# EAGLE design simm_adapter (EAGLE 9.4.2)
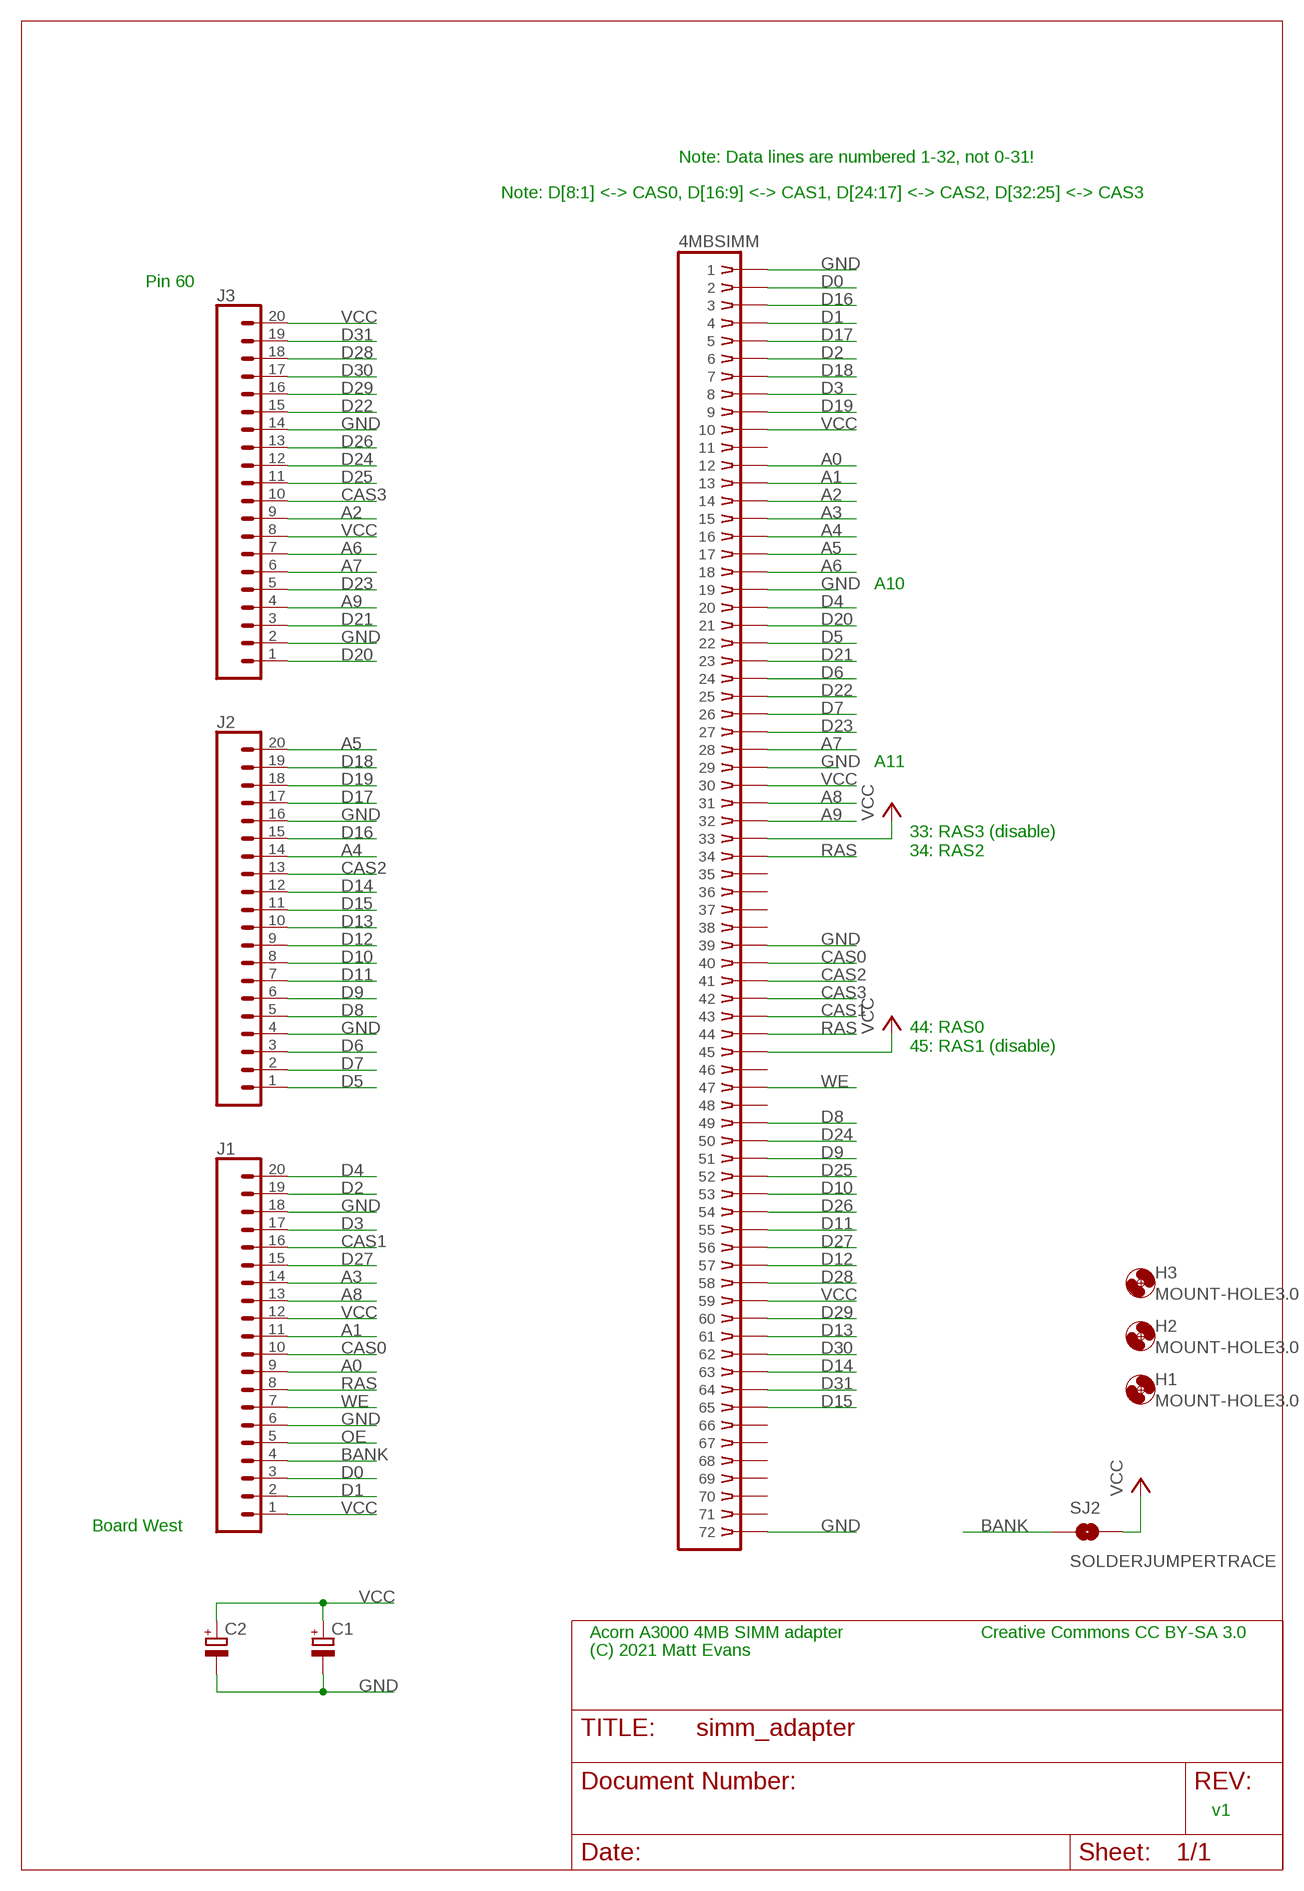
[diagram p0: schematic, sheet 1]

## Parts
4MBSIMM  SIMM72  [73826962]
C1  CPOL-EUCT7343  [CT7343]
C2  CPOL-EUCT7343  [CT7343]
H1  MOUNT-HOLE3.0  [3,0]
H2  MOUNT-HOLE3.0  [3,0]
H3  MOUNT-HOLE3.0  [3,0]
J1  CONN_20  [1X20]
J2  CONN_20  [1X20]
J3  CONN_20  [1X20]
SJ2  SOLDERJUMPERTRACE  [SJ_2S-TRACE]

## Nets
A0: 4MBSIMM.12 J1.9
A1: 4MBSIMM.13 J1.11
A2: 4MBSIMM.14 J3.9
A3: 4MBSIMM.15 J1.14
A4: 4MBSIMM.16 J2.14
A5: 4MBSIMM.17 J2.20
A6: 4MBSIMM.18 J3.7
A7: 4MBSIMM.28 J3.6
A8: 4MBSIMM.31 J1.13
A9: 4MBSIMM.32 J3.4
BANK: J1.4 SJ2.1
CAS0: 4MBSIMM.40 J1.10
CAS1: 4MBSIMM.43 J1.16
CAS2: 4MBSIMM.41 J2.13
CAS3: 4MBSIMM.42 J3.10
D0: 4MBSIMM.2 J1.3
D1: 4MBSIMM.4 J1.2
D2: 4MBSIMM.6 J1.19
D3: 4MBSIMM.8 J1.17
D4: 4MBSIMM.20 J1.20
D5: 4MBSIMM.22 J2.1
D6: 4MBSIMM.24 J2.3
D7: 4MBSIMM.26 J2.2
D8: 4MBSIMM.49 J2.5
D9: 4MBSIMM.51 J2.6
D10: 4MBSIMM.53 J2.8
D11: 4MBSIMM.55 J2.7
D12: 4MBSIMM.57 J2.9
D13: 4MBSIMM.61 J2.10
D14: 4MBSIMM.63 J2.12
D15: 4MBSIMM.65 J2.11
D16: 4MBSIMM.3 J2.15
D17: 4MBSIMM.5 J2.17
D18: 4MBSIMM.7 J2.19
D19: 4MBSIMM.9 J2.18
D20: 4MBSIMM.21 J3.1
D21: 4MBSIMM.23 J3.3
D22: 4MBSIMM.25 J3.15
D23: 4MBSIMM.27 J3.5
D24: 4MBSIMM.50 J3.12
D25: 4MBSIMM.52 J3.11
D26: 4MBSIMM.54 J3.13
D27: 4MBSIMM.56 J1.15
D28: 4MBSIMM.58 J3.18
D29: 4MBSIMM.60 J3.16
D30: 4MBSIMM.62 J3.17
D31: 4MBSIMM.64 J3.19
GND: 4MBSIMM.1 4MBSIMM.19 4MBSIMM.29 4MBSIMM.39 4MBSIMM.72 C1.- C2.- J1.6 J1.18 J2.4 J2.16 J3.2 J3.14
OE: J1.5
RAS: 4MBSIMM.34 4MBSIMM.44 J1.8
VCC: 4MBSIMM.10 4MBSIMM.30 4MBSIMM.33 4MBSIMM.45 4MBSIMM.59 C1.+ C2.+ J1.1 J1.12 J3.8 J3.20 SJ2.2
WE: 4MBSIMM.47 J1.7
Unconnected: 4MBSIMM.11 4MBSIMM.35 4MBSIMM.36 4MBSIMM.37 4MBSIMM.38 4MBSIMM.46 4MBSIMM.48 4MBSIMM.66 4MBSIMM.67 4MBSIMM.68 4MBSIMM.69 4MBSIMM.70 4MBSIMM.71

## Notes on the sheet
- Note: Data lines are numbered 1-32, not 0-31!
- Note: D[8:1] <-> CAS0, D[16:9] <-> CAS1, D[24:17] <-> CAS2, D[32:25] <-> CAS3
- Pin 60
- A10
- A11
- 33: RAS3 (disable)
  34: RAS2
- 44: RAS0
  45: RAS1 (disable)
- Board West
- Acorn A3000 4MB SIMM adapter | Creative Commons CC BY-SA 3.0
- (C) 2021 Matt Evans
- v1

## Library data of the parts
4MBSIMM = con-amp:SIMM72: AMP connector
C1 C2 = rcl:CPOL-EU: POLARIZED CAPACITOR, European symbol; SPICEPREFIX: C
H1-H3 = holes:MOUNT-HOLE: MOUNTING HOLE with drill center marker
J1-J3 = SparkFun-Connectors:CONN_20: Multi connection point. Often used as Generic Header-pin footprint for 0.1 inch spaced/style header connections On any of the 0.1 inch spaced packages, you can populate with these: Break Away Headers - Straight <https://www.sparkfun.com/products/116> (PRT-00116) Break Away Male Headers - Right Angle <https://www.sparkfun.com/products/553> (PRT-00553) Female Headers <https://www.sparkfun.com/products/115> (PRT-00115) Break Away Headers - Machine Pin <https://www.sparkfun.com/products/117> (PRT-00117) Break Away Female Headers - Swiss Machine Pin <https://www.sparkfun.com/products/743> (PRT-00743) For SCREWTERMINALS and SPRING TERMINALS visit here: Screw Terimnals on SparkFun.com <https://www.sparkfun.com/search/results?term=Screw+Terminals> (5mm/3.5mm/2.54mm spacing) This device is also useful as a general connection point to wire up your design to another part of your project. Our various solder wires solder well into these plated through hole pads. Hook-Up Wire - Assortment (Stranded, 22 AWG) <https://www.sparkfun.com/products/11375> (PRT-11375) Hook-Up Wire - Assortment (Solid Core, 22 AWG) <https://www.sparkfun.com/products/11367> (PRT-11367) View the entire wire category on our website here <https://www.sparkfun.com/categories/141> Special notes: Molex polarized connector foot print use with SKU : PRT-08231 with associated crimp pins and housings. 1MM SMD Version SKU: PRT-10208 NOTES ON THE VARIANTS LOCK and LOCK_LONGPADS... This footprint was designed to help hold the alignment of a through-hole component (i.e. 6-pin header) while soldering it into place. You may notice that each hole has been shifted either up or down by 0.005 of an inch from it's more standard position (which is a perfectly straight line). This slight alteration caused the pins (the squares in the middle) to touch the edges of the holes. Because they are alternating, it causes a "brace" to hold the component in place. 0.005 has proven to be the perfect amount of "off-center" position when using our standard breakaway headers. Although looks a little odd when you look at the bare footprint, once you have a header in there, the alteration is very hard to notice. Also,if you push a header all the way into place, it is covered up entirely on the bottom side. Note about LOCK SPECIAL package: This is just like the LOCK variant in that the holes are staggared by 5 mil, but except for the last two holes. They are not altered from the "standard" footprint layout. This is used for a special purpose on the layout of our Graphic LCD Backpack. Make sure you want to use this device before selecting it for you project!
SJ2 = SparkFun-Retired:SOLDERJUMPER: Solder Jumper Standard SMD solder jumper. Used to automate production. Two varients : Normally Open and Normally Closed are the same, but have different paste layers. NC will have a large amount of paste and should jumper during reflow.

## Board
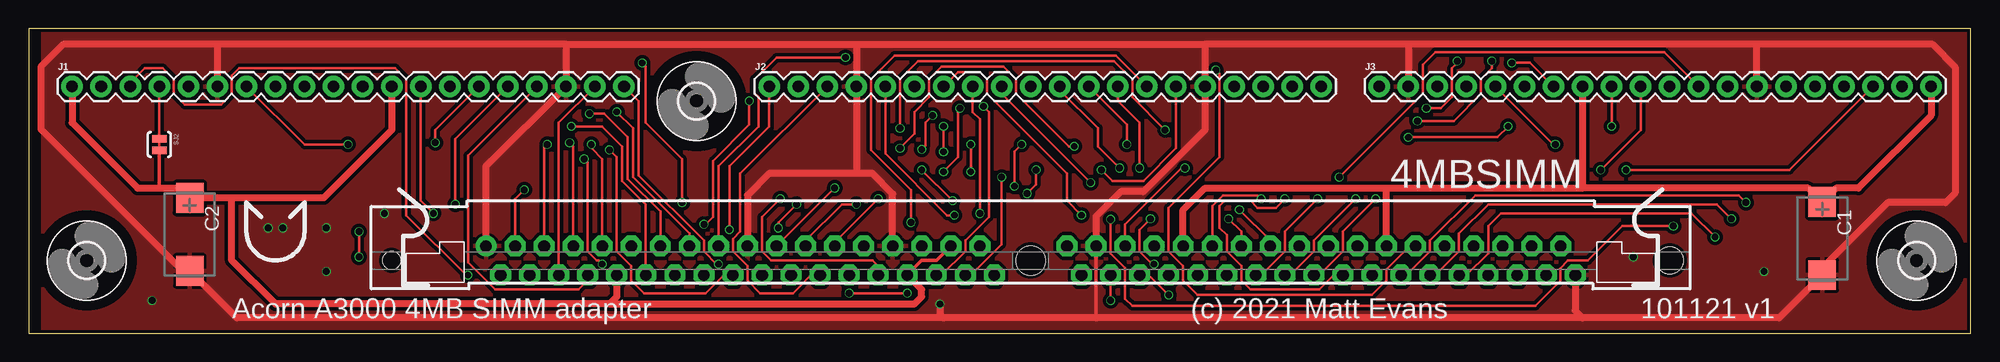
[diagram p1: board, top side]
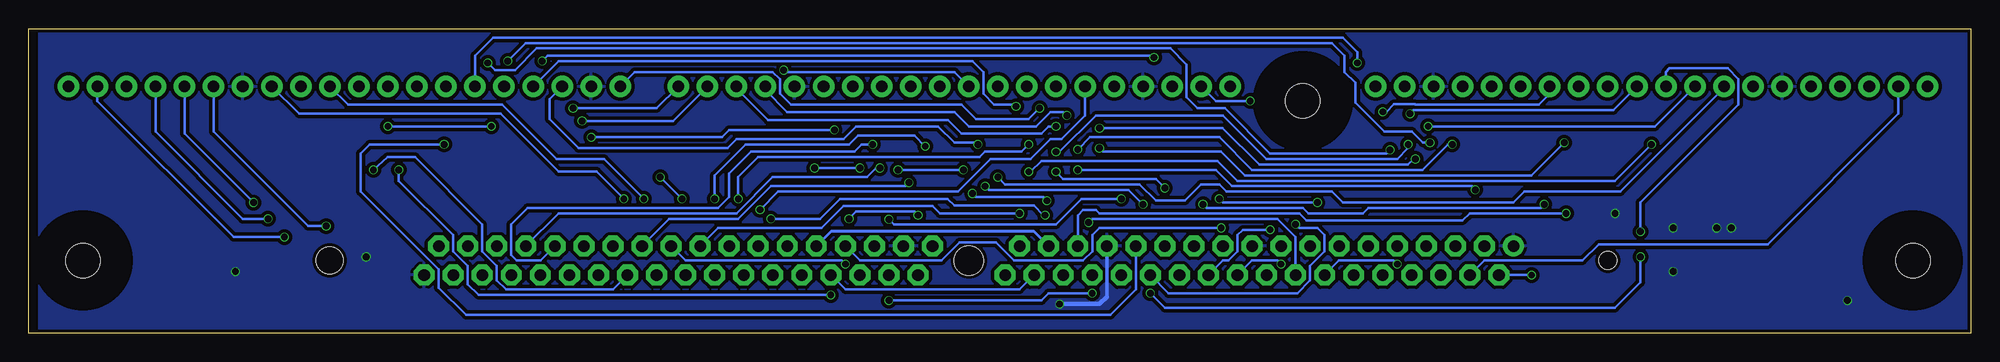
[diagram p2: board, bottom side, seen from below]

Size 169.85 x 26.66 mm. Coordinates in mm from the lower left corner, seen from the top.
Outline: 0,0 169.85,0 169.85,26.66 0,26.66 0,0
Copper layers (1*16): Top 0.035mm / dielectric 1.6mm / Bottom 0.035mm
Design rules "jlcpcb-2layers": minimum track width 5mil, minimum drill 0.3mm, track to track 5mil, track to pad 5mil, pad to pad 5mil, via to via 5mil, smd to smd 5mil, copper to edge 0.2mm, drill to drill 6mil, minimum pad ring 10mil, minimum via ring 3mil, stop-mask expansion 4mil, vias tented up to drill 0mil, thermal gap 10mil

### Footprints (pad centres in the part's own frame; a part is rotated, then mirrored left to right if it is on the bottom)
73826962 = drill 1.016: 1 47.625,-1.27 | drill 1.016 octagon: 2 46.355,1.27; 3 45.085,-1.27; 4 43.815,1.27; 5 42.545,-1.27; 6 41.275,1.27; 7 40.005,-1.27; 8 38.735,1.27; 9 37.465,-1.27; 10 36.195,1.27; 11 34.925,-1.27; 12 33.655,1.27; 13 32.385,-1.27; 14 31.115,1.27; 15 29.845,-1.27; 16 28.575,1.27; 17 27.305,-1.27; 18 26.035,1.27; 19 24.765,-1.27; 20 23.495,1.27; 21 22.225,-1.27; 22 20.955,1.27; 23 19.685,-1.27; 24 18.415,1.27; 25 17.145,-1.27; 26 15.875,1.27; 27 14.605,-1.27; 28 13.335,1.27; 29 12.065,-1.27; 30 10.795,1.27; 31 9.525,-1.27; 32 8.255,1.27; 33 6.985,-1.27; 34 5.715,1.27; 35 4.445,-1.27; 36 3.175,1.27; 37 -3.175,-1.27; 38 -4.445,1.27; 39 -5.715,-1.27; 40 -6.985,1.27; 41 -8.255,-1.27; 42 -9.525,1.27; 43 -10.795,-1.27; 44 -12.065,1.27; 45 -13.335,-1.27; 46 -14.605,1.27; 47 -15.875,-1.27; 48 -17.145,1.27; 49 -18.415,-1.27; 50 -19.685,1.27; 51 -20.955,-1.27; 52 -22.225,1.27; 53 -23.495,-1.27; 54 -24.765,1.27; 55 -26.035,-1.27; 56 -27.305,1.27; 57 -28.575,-1.27; 58 -29.845,1.27; 59 -31.115,-1.27; 60 -32.385,1.27; 61 -33.655,-1.27; 62 -34.925,1.27; 63 -36.195,-1.27; 64 -37.465,1.27; 65 -38.735,-1.27; 66 -40.005,1.27; 67 -41.275,-1.27; 68 -42.545,1.27; 69 -43.815,-1.27; 70 -45.085,1.27; 71 -46.355,-1.27; 72 -47.625,1.27 | hole 2.362: -55.88,0 | hole 1.575: 55.88,0 | hole 2.54: 0,0
CT7343 = smd 2.6 x 2.4: + -3.2,0; - 3.2,0
3,0 = hole 3: 0,0
1X20 = drill 1.016 pad 1.88: 1 0,0; 2 2.54,0; 3 5.08,0; 4 7.62,0; 5 10.16,0; 6 12.7,0; 7 15.24,0; 8 17.78,0; 9 20.32,0; 10 22.86,0; 11 25.4,0; 12 27.94,0; 13 30.48,0; 14 33.02,0; 15 35.56,0; 16 38.1,0; 17 40.64,0; 18 43.18,0; 19 45.72,0; 20 48.26,0
SJ_2S-TRACE = smd 0.635 x 1.27: 1 -0.508,0; 2 0.508,0

### Placement (x,y rotation side)
4MBSIMM  87.63,6.35 180 top
C1  156.84,8.28 270 top
C2  14.1,8.64 270 top
H1  5.08,6.35 0 top
H2  165.1,6.35 0 top
H3  58.42,20.32 0 top
J1  3.81,21.59 0 top
J2  64.77,21.59 0 top
J3  118.11,21.59 0 top
SJ2  11.43,16.51 270 top

### Tracks (layer width: path | path; a pad name or v marks a point on that pad's centre or on a via)
A0  (via drill 0.6)
  Top 0.203: 4MBSIMM.12 53.98,11.27 51.91,13.34 51.91,16.35 50.16,18.1 v47.47,18.1
  Bottom 0.203: v47.47,18.1 27.62,18.1 J1.9
A1  (via drill 0.6)
  Top 0.203: 4MBSIMM.13 55.24,10.64 52.39,13.49 52.39,17.14 50.32,19.21 v49.05,19.21
  Bottom 0.203: v49.05,19.21 48.74,19.53 31.27,19.53 J1.11
A2  (via drill 0.6)
  Top 0.203: v50.16,6.03 49.85,6.35 49.69,6.35 48.9,7.14 48.9,14.92 v48.58,15.24 | v99.38,17.78 96.52,20.64 96.52,22.23 94.93,23.81 77.79,23.81 76.2,22.23 v76.2,17.94 | v120.65,17.14 128.43,17.14 v129.38,18.1 | J3.9 v138.43,18.1
  Bottom 0.203: 4MBSIMM.14 55.24,6.35 50.48,6.35 v50.16,6.03 | v120.65,17.14 109.22,17.14 108.58,17.78 v99.38,17.78 | v138.43,18.1 v129.38,18.1 | v48.58,15.24 48.71,15.24 49.21,14.74 62.23,14.74 65.43,17.94 v76.2,17.94
A3  (via drill 0.6)
  Top 0.203: 4MBSIMM.15 57.78,8.73 52.86,13.65 52.86,17.94 v51.44,19.37
  Bottom 0.203: J1.14 36.83,20.95 37.78,20 48.58,20 48.6,20.03 50.46,20.03 51.12,19.37 v51.44,19.37
A4  (via drill 0.6)
  Top 0.203: v77.15,9.68 77.15,12.54 73.66,16.03 73.66,22.23 75.72,24.29 95.09,24.29 J2.14
  Bottom 0.203: 4MBSIMM.16 59.05,8.41 60.64,10 76.83,10 v77.15,9.68
A5  (via drill 0.6)
  Top 0.203: 4MBSIMM.17 60.33,14.61 63.82,18.1 63.82,20.64 63.5,20.95 63.5,22.23 65.41,24.13 v71.44,24.13 | v124.94,23.81 124.94,23.65 124.46,23.18 124.46,20.64 123.51,19.69 v122.24,19.69
  Bottom 0.203: v71.44,24.13 71.6,24.29 124.46,24.29 v124.94,23.81 | v122.24,19.69 114.94,19.69 J2.20
A6  (via drill 0.6)
  Top 0.203: 4MBSIMM.18 60.8,5.08 59.21,3.49 53.82,3.49 52.7,4.6 52.7,5.87 51.44,7.14 51.44,15.4 v50.8,16.03 | v129.7,23.65 131.29,23.65 J3.7
  Bottom 0.203: v50.8,16.03 51.12,15.72 61.28,15.72 65.25,19.69 67.63,19.69 68.58,20.64 68.58,23.49 70.01,24.92 125.41,24.92 127.32,23.02 129.06,23.02 v129.7,23.65
A7  (via drill 0.6)
  Top 0.203: 4MBSIMM.28 74.3,5.87 73.82,6.35 64.93,6.35 64.14,7.14 64.14,10.16 v65.72,11.75 | v57.15,11.43 57.15,15.24 53.98,18.41 53.98,23.34 v53.66,23.65
  Bottom 0.203: v65.72,11.75 65.41,11.43 v57.15,11.43 | v53.66,23.65 53.66,24.61 54.93,25.88 129.22,25.88 130.81,24.29 J3.6
A8  (via drill 0.6)
  Top 0.203: v35.4,10.48 34.29,11.59 J1.13
  Bottom 0.203: 4MBSIMM.31 78.11,10.32 77.63,10.79 76.52,10.79 76.2,10.48 58.74,10.48 58.1,9.84 44.45,9.84 43.81,10.48 v35.4,10.48
A9  (via drill 0.6)
  Top 0.203: 4MBSIMM.32 79.85,5.08 81.92,7.14 81.92,8.1 83.98,10.16 83.98,19.37 v83.5,19.84
  Bottom 0.203: v83.5,19.84 83.66,20 85.41,20 86.36,20.95 86.36,22.86 87.31,23.81 123.51,23.81 J3.4
BANK
  Top 0.203: SJ2.1 J1.4
CAS0  (via drill 0.6)
  Top 0.203: 4MBSIMM.40 v94.61,2.86 | v76.83,3.49 v71.75,3.49 | v28.89,8.89 v28.89,6.67
  Bottom 0.203: v94.61,2.86 81.28,2.86 80.64,3.49 v76.83,3.49 | v71.75,3.49 70.48,2.22 31.11,2.22 28.89,4.45 v28.89,6.67 | v28.89,8.89 28.89,11.43 20.32,20 20.32,22.23 21.27,23.18 26.35,23.18 26.67,22.86 J1.10
CAS1  (via drill 0.6)
  Top 0.203: v65.56,9.21 65.56,9.68 v67.15,11.27 | v37.31,11.27 37.31,16.99 J1.16
  Bottom 0.203: 4MBSIMM.43 97.16,6.35 90.01,6.35 88.42,7.94 85.25,7.94 83.66,6.35 77.63,6.35 76.83,7.14 76.83,8.57 76.2,9.21 v65.56,9.21 | v67.15,11.27 66.83,10.95 58.42,10.95 57.94,10.48 53.18,10.48 52.7,10.95 37.62,10.95 v37.31,11.27
CAS2  (via drill 0.6)
  Top 0.203: 4MBSIMM.41 95.89,9.53 100.81,14.45 v101.12,14.45 | v97.16,14.45 97.16,18.41 95.25,20.32 J2.13
  Bottom 0.203: v101.12,14.45 v97.16,14.45
CAS3  (via drill 0.6)
  Top 0.203: 4MBSIMM.42 97.95,5.08 v99.69,3.33 | v137.48,14.29 140.97,17.78 J3.10
  Bottom 0.203: v99.69,3.33 130.49,3.33 131.44,4.29 131.44,5.87 132.72,7.14 132.72,8.57 137.48,13.34 v137.48,14.29
D0  (via drill 0.6)
  Top 0.203: v38.42,5.08 38.26,5.08 33.02,10.32 33.02,22.23 32.07,23.18 18.41,23.18 17.78,22.54 17.78,20.95 16.83,20 13.65,20 12.7,20.95 12.7,22.23 11.75,23.18 10.16,23.18 8.89,21.91 J1.3
  Bottom 0.203: v38.42,5.08 4MBSIMM.2
D1
  Bottom 0.203: 4MBSIMM.4 42.55,6.35 33.97,6.35 32.54,7.78 17.78,7.78 6.35,19.21 J1.2
D2
  Top 0.203: 4MBSIMM.6 46.35,18.41 J1.19
D3
  Top 0.203: 4MBSIMM.8 48.9,4.6 48.1,3.81 40.8,3.81 38.42,6.19 38.42,15.56 J1.17
D4  (via drill 0.6)
  Top 0.203: v60.33,6.03 60.17,6.03 59.05,7.14 59.05,8.1 53.34,13.81 53.34,20.32 J1.20
  Bottom 0.203: 4MBSIMM.20 62.87,6.35 60.64,6.35 v60.33,6.03
D5  (via drill 0.6)
  Top 0.203: v61.28,9.05 61.28,14.61 64.77,18.1 J2.1
  Bottom 0.203: 4MBSIMM.22 65.41,6.35 64.93,6.35 64.14,7.14 64.14,8.57 63.66,9.05 v61.28,9.05
D6
  Top 0.203: 4MBSIMM.24 68.42,5.08 66.83,3.49 63.98,3.49 62.87,4.6 62.87,5.87 61.59,7.14 61.59,8.25 62.23,8.89 62.23,13.97 J2.3
D7  (via drill 0.6)
  Top 0.203: v59.05,9.53 59.21,9.53 59.85,10.16 59.85,15.08 63.02,18.26 v63.02,20.32
  Bottom 0.203: 4MBSIMM.26 70.17,3.49 58.9,3.49 57.78,4.6 57.78,5.87 56.52,7.14 56.52,8.57 57.15,9.21 58.74,9.21 v59.05,9.53 | v63.02,20.32 66.04,20.32 J2.2
D8  (via drill 0.6)
  Top 0.203: 4MBSIMM.49 106.05,8.89 v104.93,10 | v80.96,10.32 80.33,10.32 74.93,15.72 J2.5
  Bottom 0.203: v104.93,10 100.65,10 98.9,11.75 89.49,11.75 88.9,11.16 81.95,11.16 81.11,10.32 v80.96,10.32
D9  (via drill 0.6)
  Top 0.203: 4MBSIMM.51 108.58,8.1 v105.89,10.79
  Bottom 0.203: v105.89,10.79 104.3,12.38 88.58,12.38 85.72,15.24 82.23,15.24 80.49,16.99 79.53,16.99 77.47,19.05 J2.6
D10  (via drill 0.6)
  Top 0.203: v83.19,10.48 83.19,18.73 82.55,19.37 J2.8
  Bottom 0.203: 4MBSIMM.53 109.54,9.21 100.49,9.21 98.58,11.11 90.81,11.11 90.17,10.48 v83.19,10.48
D11  (via drill 0.6)
  Top 0.203: v98.42,6.03 98.27,6.03 97.16,7.14 97.16,9.05 v98.11,10 | v92.08,10.32 90.81,11.59 90.81,13.97 83.82,20.95 83.82,22.23 83.19,22.86 81.28,22.86 J2.7
  Bottom 0.203: 4MBSIMM.55 112.39,6.35 98.74,6.35 v98.42,6.03 | v92.08,10.32 92.39,10.64 97.47,10.64 v98.11,10
D12  (via drill 0.6)
  Top 0.203: J2.9 85.09,20.95 v92.87,13.18
  Bottom 0.203: 4MBSIMM.57 113.82,10 107.79,10 104.93,12.86 93.19,12.86 v92.87,13.18
D13  (via drill 0.6)
  Top 0.203: 4MBSIMM.61 120.81,7.62 118.75,5.56 118.75,4.6 117.47,3.33 102.23,3.33 100.97,4.6 100.97,5.87 99.69,7.14 99.69,10.95 104.14,15.4 104.14,22.7 v103.82,23.02
  Bottom 0.203: v103.82,23.02 103.66,22.86 88.9,22.86 J2.10
D14  (via drill 0.6)
  Top 0.203: v96.04,16.51 96.04,18.26 J2.12
  Bottom 0.203: 4MBSIMM.63 125.09,6.35 127.16,6.35 127.64,6.83 127.64,9.53 126.21,10.95 109.54,10.95 108.58,11.91 108.58,13.97 106.68,15.88 97.63,15.88 97,16.51 v96.04,16.51
D15  (via drill 0.6)
  Top 0.203: v95.41,14.45 93.5,16.35 93.5,17.94 90.17,21.27 J2.11
  Bottom 0.203: 4MBSIMM.65 123.51,10.48 107.95,10.48 104.78,13.65 96.52,13.65 95.73,14.45 v95.41,14.45
D16  (via drill 0.6)
  Top 0.203: 4MBSIMM.3 42.55,11.75 v43.34,12.54 | v80.8,11.59 v78.11,14.29 | v88.11,14.29 88.11,13.02 v87.31,12.22 | v93.82,14.29 94.77,13.34 97.47,13.34 100.33,16.19 J2.15
  Bottom 0.203: v43.34,12.54 43.66,12.86 64.61,12.86 66.04,14.29 v78.11,14.29 | v87.31,12.22 87,11.91 81.12,11.91 v80.8,11.59 | v93.82,14.29 v88.11,14.29
D17  (via drill 0.6)
  Top 0.203: 4MBSIMM.5 45.09,16.24 v45.36,16.51 | v79.06,19.05 78.42,18.41 78.42,16.4 v78.11,16.08
  Bottom 0.203: J2.17 105.41,21.27 103.5,19.37 88.9,19.37 87.63,18.1 81.75,18.1 80.48,19.37 79.38,19.37 v79.06,19.05 | v78.11,16.08 77.04,17.14 65.72,17.14 62.85,14.28 47.95,14.28 45.72,16.51 v45.36,16.51
D18  (via drill 0.6)
  Top 0.203: 4MBSIMM.7 47.62,16.35 v47.31,16.67 | v127.95,23.81 127.95,23.18 127,22.23 127,20.95 124.62,18.57 v121.44,18.57
  Bottom 0.203: v47.31,16.67 47.94,16.67 48.9,17.62 51.28,17.62 53.82,20.16 53.82,21.91 54.77,22.86 54.77,24.29 55.88,25.4 126.36,25.4 v127.95,23.81 | v121.44,18.57 113.51,18.57 J2.19
D19  (via drill 0.6)
  Top 0.203: 4MBSIMM.9 50.16,15.24 49.21,16.19 v49.21,16.51 | v80.01,15.88 v80.01,18.1
  Bottom 0.203: v49.21,16.51 49.21,16.19 50.16,15.24 61.59,15.24 65.41,19.05 76.52,19.05 79.69,15.88 v80.01,15.88 | J2.18 107.95,21.42 105.18,18.64 89.45,18.64 88.27,17.46 81.28,17.46 80.64,18.1 v80.01,18.1
D20  (via drill 0.6)
  Top 0.203: v70.48,12.7 4MBSIMM.21 | v80.01,14.13 81.28,15.4 81.28,19.53 v81.44,19.69
  Bottom 0.203: v70.48,12.7 71.28,13.49 79.38,13.49 v80.01,14.13 | J3.1 116.84,22.86 104.78,22.86 104.14,22.23 104.14,20.95 103.19,20 88.27,20 87,18.73 82.39,18.73 v81.44,19.69
D21  (via drill 0.6)
  Top 0.203: 4MBSIMM.23 67.94,8.1 71.12,11.27 v72.39,11.27 | v86.84,16.51 86.2,15.88 v86.2,12.86
  Bottom 0.203: v86.2,12.86 85.88,12.54 73.66,12.54 v72.39,11.27 | v86.84,16.51 87,16.67 88.9,16.67 90.33,18.1 97.47,18.1 98.58,16.99 107.95,16.99 108.74,16.19 121.76,16.19 124.3,18.73 124.3,20.48 J3.3
D22  (via drill 0.6)
  Top 0.203: v143.83,9.37 139.38,9.37 136.37,6.35 134.62,6.35 133.91,5.64 133.91,5.61 133.93,5.58 133.93,4.55 131.76,2.38 96.52,2.38 95.89,3.02 95.89,5.71 94.61,6.99 v94.61,9.96 | v74.3,11.75 70.48,7.94 4MBSIMM.25
  Bottom 0.203: v74.3,11.75 77.79,11.75 80.01,9.53 94.19,9.53 v94.61,9.96 | J3.15 153.67,17.62 145.41,9.37 v143.83,9.37
D23  (via drill 0.6)
  Top 0.203: v133.51,16.51 133.35,16.51 J3.5
  Bottom 0.203: 4MBSIMM.27 73.03,3.81 75.25,1.59 131.6,1.59 133.99,3.97 133.99,5.56 140.81,12.38 140.81,15.72 140.02,16.51 v133.51,16.51
D24  (via drill 0.6)
  Top 0.203: 4MBSIMM.50 107.79,5.08 109.86,7.14 109.86,8.89 v112.71,11.75 | v114.62,13.65 121.92,20.95 121.92,23.49 123.03,24.61 143.03,24.61 J3.12
  Bottom 0.203: v114.62,13.65 v112.71,11.75
D25  (via drill 0.6)
  Top 0.203: 4MBSIMM.52 110.33,5.08 112.39,7.14 112.39,8.1 v116.05,11.75
  Bottom 0.203: v116.05,11.75 119.54,15.24 123.67,15.24 128.43,20 141.92,20 J3.11
D26  (via drill 0.6)
  Top 0.203: 4MBSIMM.54 112.87,5.08 114.94,7.14 114.94,8.89 v117.79,11.75
  Bottom 0.203: v117.79,11.75 120.17,14.13 123.51,14.13 128.59,19.21 146.21,19.21 J3.13
D27  (via drill 0.6)
  Top 0.203: 4MBSIMM.56 114.14,5.08 112.87,3.81 106.84,3.81 106.05,4.6 106.05,5.87 104.78,7.14 104.78,8.57 104.14,9.21 104.14,11.11 104.62,11.59 106.84,11.59 107.47,10.95 109.06,10.95 v109.86,11.75 | v91.44,16.35 90.96,16.35 86.36,20.95 86.36,22.23 85.25,23.34 79.85,23.34 78.74,22.23 78.74,20.64 77.47,19.37 77.47,17.46 v76.2,16.19 | v35.56,16.67 35.56,17.78 J1.15
  Bottom 0.203: v109.86,11.75 109.86,13.81 107.16,16.51 98.11,16.51 97.31,17.3 92.39,17.3 v91.44,16.35 | v76.2,16.19 75.88,15.88 65.56,15.88 63.5,13.81 38.42,13.81 v35.56,16.67
D28  (via drill 0.6)
  Top 0.203: J3.18 153.99,14.29 v139.7,14.29
  Bottom 0.203: 4MBSIMM.58 118.75,3.81 128.11,3.81 128.91,4.6 128.91,5.87 130.18,7.14 130.18,9.53 136.05,15.4 138.43,15.4 v139.7,14.29
D29  (via drill 0.6)
  Top 0.203: 4MBSIMM.60 120.49,5.08 122.56,7.14 122.56,8.1 126.52,12.07 149.54,12.07 v150.18,11.43
  Bottom 0.203: v150.18,11.43 156.21,17.46 J3.16
D30  (via drill 0.6)
  Top 0.203: 4MBSIMM.62 123.03,5.08 125.09,7.14 125.09,8.73 127.64,11.27 147.64,11.27 v148.91,10
  Bottom 0.203: v148.91,10 151.13,10 158.75,17.62 J3.17
D31  (via drill 0.6)
  Top 0.203: 4MBSIMM.64 125.73,5.08 127.64,6.99 127.64,9.37 128.75,10.48 145.41,10.48 v147.48,8.41
  Bottom 0.203: J3.19 163.83,20.32 151.92,8.41 v147.48,8.41
GND  (via drill 0.6)
  Top 0.203: 156.84,5.71 C1.- | 13.49,5.44 C2.-
  Top 0.305: 4MBSIMM.39 93.34,1.32
  Top 0.61: J3.14 151.13,25.27 | 151.13,25.27 166.5,25.27 168.48,23.29 168.48,12.27 167.64,11.43 162.56,11.43 156.84,5.71 | 120.65,25.27 J3.2 | 102.87,25.27 J2.16 102.87,17.78 97.47,12.38 95.5,12.38 93.34,10.22 4MBSIMM.39 | 72.39,25.27 J2.4 72.39,13.97 | 46.99,25.27 72.39,25.27 | 46.99,25.27 J1.18 40.01,14.61 4MBSIMM.1 | 46.99,25.27 16.51,25.27 | 16.51,25.27 J1.6 | 16.51,25.27 3.05,25.27 1.08,23.3 1.08,17.84 13.49,5.44 | 151.13,25.27 120.65,25.27 | 120.65,25.27 102.87,25.27 | C1.- 153.09,1.32 135.89,1.32 | C2.- 18.21,1.32 80.01,1.32 | 135.89,1.32 93.34,1.32 80.01,1.32 | 4MBSIMM.72 135.25,1.96 135.89,1.32 | 4MBSIMM.29 75.56,12.19 73.79,13.97 72.39,13.97 | 72.39,13.97 64.77,13.97 62.87,12.07 4MBSIMM.19 | v79.69,2.54 79.69,1.64 80.01,1.32 | 72.39,25.27 102.87,25.27
  Bottom 0.305: 75.56,3.17 4MBSIMM.29
  Bottom 0.406: v79.69,2.54 76.2,2.54 75.56,3.17
  other vias: 31.11,10.48 26.04,9.21 20.95,9.21 22.23,9.21 26.04,5.4 10.79,2.86 140.34,6.67 151.76,5.4
  pour Top (isolate 0.305): 1.27,26.67 1.27,0 170.18,0 170.18,26.67
  pour Bottom (isolate 0.305): 0,26.67 0,0 168.91,0 168.91,26.67
RAS  (via drill 0.6)
  Top 0.203: v85.09,13.65 85.09,7.78 82.39,5.08 4MBSIMM.34
  Bottom 0.203: 4MBSIMM.34 83.19,3.81 98.42,3.81 4MBSIMM.44 | J1.8 21.59,21.43 30.64,12.38 39.05,12.38 40.01,11.43 54.93,11.43 55.88,12.38 65.09,12.38 65.72,13.02 67.31,13.02 68.74,11.59 71.28,11.59 72.71,13.02 84.45,13.02 v85.09,13.65
VCC
  Top 0.305: 4MBSIMM.33 79.38,6.35 78.11,6.35 4MBSIMM.30 | SJ2.2 11.43,12.7
  Top 0.61: J1.1 3.81,18.41 9.53,12.7 11.43,12.7 13.23,12.7 C2.+ 17.78,11.84 | J3.20 166.37,19.05 160.02,12.7 158.06,12.7 C1.+ 155.62,12.7 135.89,12.7 | J1.12 31.75,17.78 25.81,11.84 17.78,11.84 | J3.8 135.89,12.7 | 4MBSIMM.45 100.97,10.79 102.87,12.7 118.75,12.7 | 118.75,12.7 135.89,12.7 | 4MBSIMM.59 118.75,12.7 | 4MBSIMM.10 51.44,3.17 50.8,2.54 | 50.8,2.54 21.59,2.54 17.78,6.35 17.78,11.84 | 50.8,2.54 77.47,2.54 78.11,3.17 78.11,3.81 4MBSIMM.30
  Bottom 0.254: 4MBSIMM.45 99.69,8.89 81.92,8.89 4MBSIMM.33
WE  (via drill 0.6)
  Top 0.203: 4MBSIMM.47 103.5,11.11 104.46,12.07 107.47,12.07 v107.79,11.75 | v82.39,14.13 v82.39,16.51 | v27.94,16.51 24.13,16.51 J1.7
  Bottom 0.203: v82.39,16.51 83.03,15.88 86.2,15.88 86.68,15.4 106.05,15.4 107.79,13.65 v107.79,11.75 | v27.94,16.51 31.11,13.34 64.14,13.34 65.88,15.08 81.29,15.08 82.24,14.13 v82.39,14.13

### Text on the board
tPlace: Acorn A3000 4MB SIMM adapter | (c) 2021 Matt Evans | 101121 v1